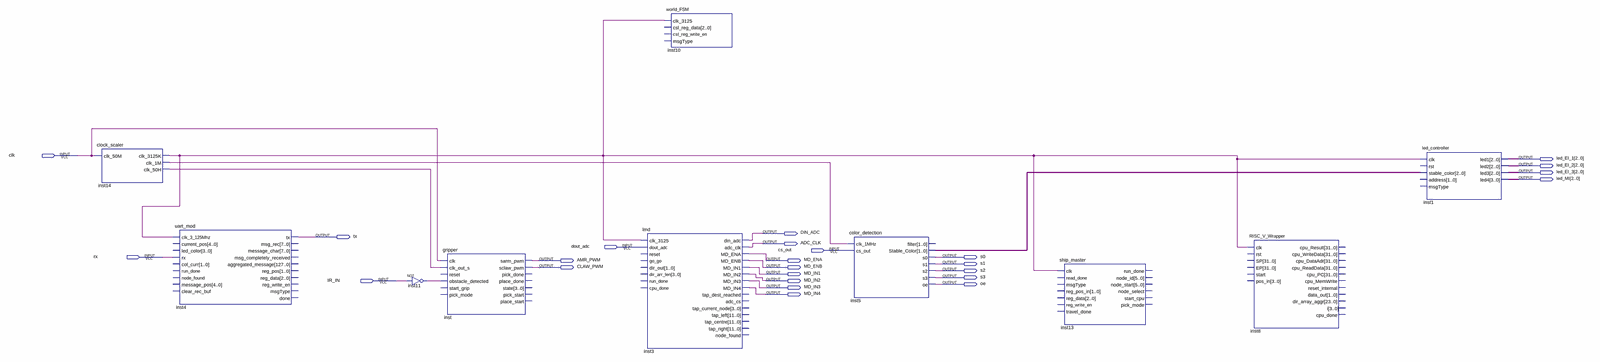
[diagram p0: schematic sheet, whole]
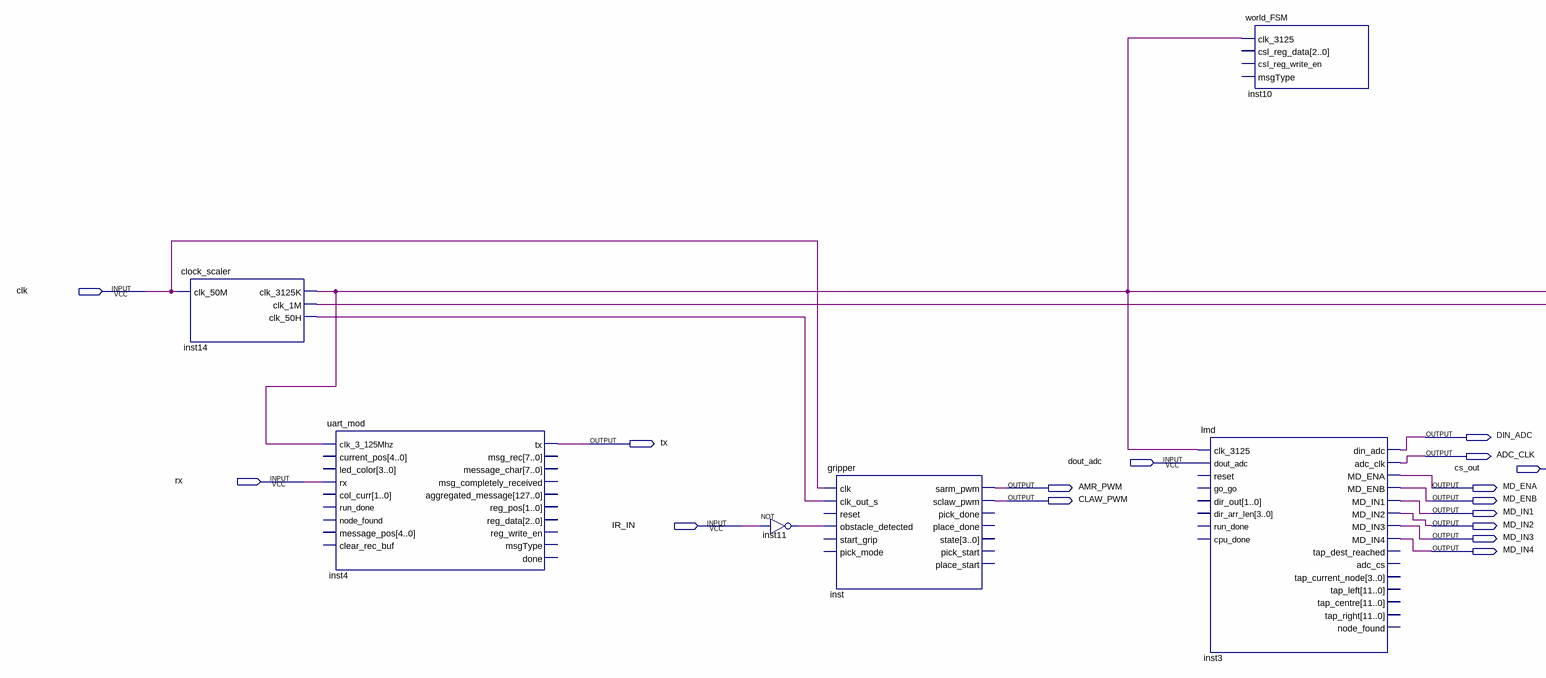
[diagram p1: schematic sheet, left part]
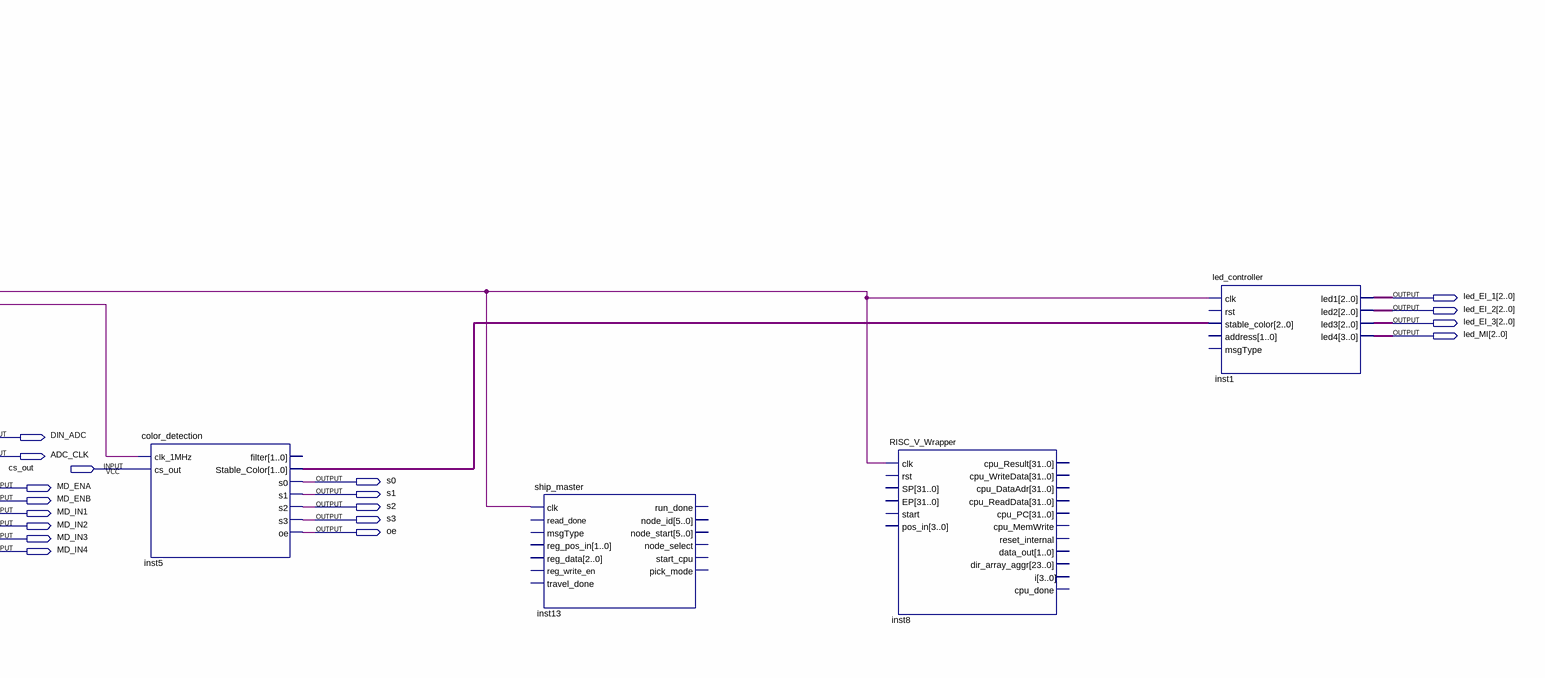
[diagram p2: schematic sheet, right part]
// Quartus schematic Clean_Babe.bdf as structural Verilog: 10 symbols, 25 pins
module Clean_Babe (
  input  clk,
  input  dout_adc,
  input  cs_out,
  input  rx,
  input  IR_IN,
  output [2:0] led_EI_1,
  output [2:0] led_EI_2,
  output [2:0] led_EI_3,
  output [2:0] led_MI,
  output DIN_ADC,
  output tx,
  output ADC_CLK,
  output s0,
  output AMR_PWM,
  output MD_ENA,
  output s1,
  output CLAW_PWM,
  output MD_ENB,
  output s2,
  output MD_IN1,
  output s3,
  output MD_IN2,
  output oe,
  output MD_IN3,
  output MD_IN4
);

  wire inst11_out, inst14_clk_1m, inst14_clk_50h, inst14_clk_3125k;
  wire [2:0] inst5_stable_color;

  clock_scaler inst14 (.clk_50M(clk), .clk_3125K(inst14_clk_3125k), .clk_1M(inst14_clk_1m), .clk_50H(inst14_clk_50h));
  uart_mod inst4 (
    .clk_3_125Mhz(inst14_clk_3125k), .rx(rx), .tx(tx));  // open: current_pos, led_color, col_curr, run_done, node_found, message_pos, clear_rec_buf, msg_rec, message_char, msg_completely_received, aggregated_message, reg_pos, reg_data, reg_write_en, msgType, done
  not inst11 (inst11_out, IR_IN);
  gripper inst (
    .clk(clk), .clk_out_s(inst14_clk_50h), .obstacle_detected(inst11_out), .sarm_pwm(AMR_PWM),
    .sclaw_pwm(CLAW_PWM));  // open: reset, start_grip, pick_mode, pick_done, place_done, state, pick_start, place_start
  lmd inst3 (
    .clk_3125(inst14_clk_3125k), .dout_adc(dout_adc), .din_adc(DIN_ADC), .adc_clk(ADC_CLK), .MD_ENA(MD_ENA),
    .MD_ENB(MD_ENB), .MD_IN1(MD_IN1), .MD_IN2(MD_IN2), .MD_IN3(MD_IN3), .MD_IN4(MD_IN4));  // open: reset, go_go, dir_out, dir_arr_len, run_done, cpu_done, tap_dest_reached, adc_cs, tap_current_node, tap_left, tap_centre, tap_right, node_found
  world_FSM inst10 (.clk_3125(inst14_clk_3125k));  // open: csl_reg_data, csl_reg_write_en, msgType
  color_detection inst5 (
    .clk_1MHz(inst14_clk_1m), .cs_out(cs_out), .Stable_Color(inst5_stable_color), .s0(s0), .s1(s1), .s2(s2),
    .s3(s3), .oe(oe));  // open: filter
  ship_master inst13 (.clk(inst14_clk_3125k));  // open: read_done, msgType, reg_pos_in, reg_data, reg_write_en, travel_done, run_done, node_id, node_start, node_select, start_cpu, pick_mode
  RISC_V_Wrapper inst8 (.clk(inst14_clk_3125k));  // open: rst, SP, EP, start, pos_in, cpu_Result, cpu_WriteData, cpu_DataAdr, cpu_ReadData, cpu_PC, cpu_MemWrite, reset_internal, data_out, dir_array_aggr, i, cpu_done
  led_controller inst1 (
    .clk(inst14_clk_3125k), .stable_color(inst5_stable_color), .led1(led_EI_1), .led2(led_EI_2),
    .led3(led_EI_3), .led4(led_MI));  // open: rst, address, msgType
endmodule
